# Altium schematic sheet TEMP+HEATER.SchDoc
size A4
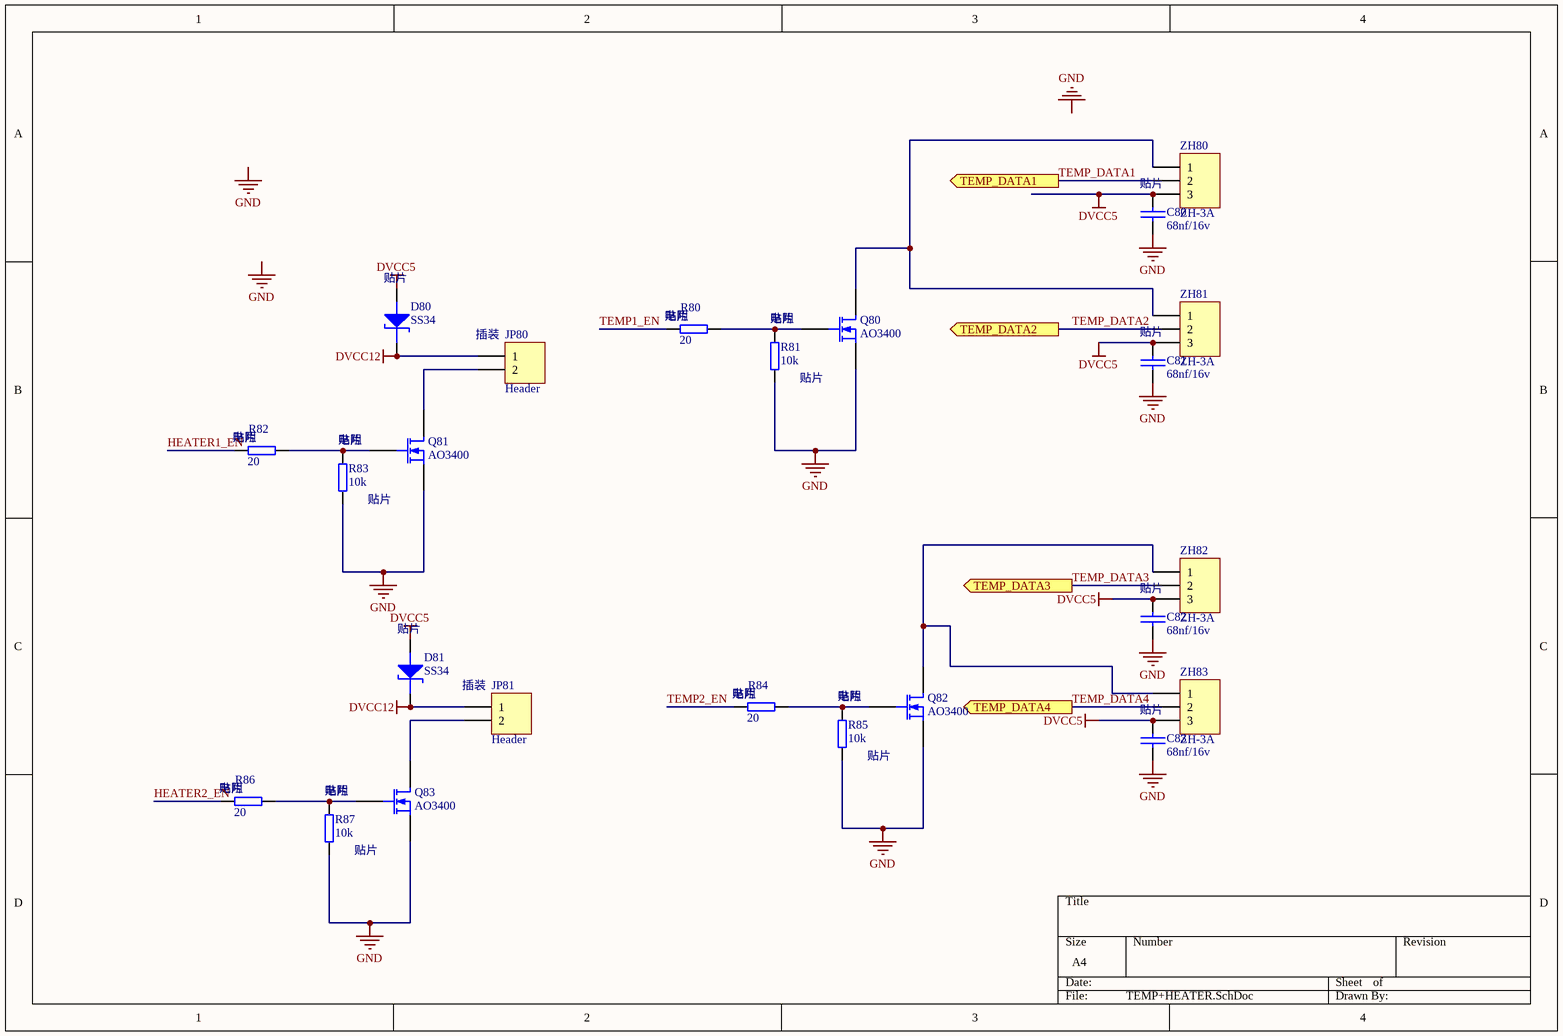
[diagram p0: TEMP+HEATER.SchDoc]

## Parts
C80  68nf/16v  [C0402]
C81  68nf/16v  [C0402]
C82  68nf/16v  [C0402]
C83  68nf/16v  [C0402]
D80  SS34  [BGY220D]
D81  SS34  [BGY220D]
JP80  Header  [PTC]
JP81  Header  [PTC]
Q80  AO3400  [SI2300]
Q81  AO3400  [SI2300]
Q82  AO3400  [SI2300]
Q83  AO3400  [SI2300]
R80  20  [R0402]
R81  10k  [R0402]
R82  20  [R0402]
R83  10k  [R0402]
R84  20  [R0402]
R85  10k  [R0402]
R86  20  [R0402]
R87  10k  [R0402]
ZH80  ZH-3A  [DS18B20]
ZH81  ZH-3A  [DS18B20]
ZH82  ZH-3A  [DS18B20]
ZH83  ZH-3A  [DS18B20]

## Ports
TEMP_DATA1 (out), TEMP_DATA2 (out), TEMP_DATA3 (out), TEMP_DATA4 (out)

## Nets
DVCC5: C80.2 C81.2 C82.2 C83.2 D80.1(A) D81.1(A) ZH80.3 ZH81.3 ZH82.3 ZH83.3
DVCC12: D80.2(K) D81.2(K) JP80.1 JP81.1
GND: C80.1 C81.1 C82.1 C83.1 Q80.3(S) Q81.3(S) Q82.3(S) Q83.3(S) R81.2 R83.2 R85.2 R87.2
HEATER1_EN: R82.2
HEATER2_EN: R86.2
TEMP1_EN: R80.2
TEMP2_EN: R84.2
TEMP_DATA1: ZH80.2 ; port TEMP_DATA1
TEMP_DATA2: ZH81.2 ; port TEMP_DATA2
TEMP_DATA3: ZH82.2 ; port TEMP_DATA3
TEMP_DATA4: ZH83.2 ; port TEMP_DATA4
NetJP80_2: JP80.2 Q81.1(D)
NetJP81_2: JP81.2 Q83.1(D)
NetQ80_1: Q80.1(D) ZH80.1 ZH81.1
NetQ80_2: Q80.2(G) R80.1 R81.1
NetQ81_2: Q81.2(G) R82.1 R83.1
NetQ82_1: Q82.1(D) ZH82.1 ZH83.1
NetQ82_2: Q82.2(G) R84.1 R85.1
NetQ83_2: Q83.2(G) R86.1 R87.1

## Notes on the sheet
- Labels drawn without touching a wire or pin: GND
- (in symbol 1N5819) 贴片
- (in symbol CC) 贴片
- (in symbol Header 2) 插装
- (in symbol MOSFET-N) 贴片
- (in symbol RES1) 电阻; 贴片

## Library data of the parts
C80-C83 = CC: C; 大?: 0.1uf/50v; 封?: 0603
D80 D81 = 1N5819: 型?: 1N5819/SS14; 产?: *; 厂?: *; 大?: *; 封?: *; 价?: *; 资?: *
JP80 JP81 = Header 2: Header, 2-Pin; 产地: *; 厂商: *; 大小: *; 封?: *; 资?: *; 价格: *
Q80-Q83 = MOSFET-N: N-Channel MOSFET; pin to pad: 1>3 2>1 3>2; 元?: N-MOS; 产地: *; 厂商: *; 大小: *; 封?: *; 型号: AO3400; 物?: *
R80-R87 = RES1: 价格: 0.01; 封?: 0603
  R80 R82 R84 R86: 大小: 20
  R81 R83 R85 R87: 大小: 10k
ZH80-ZH83 = ZH-3A: 1.5mm; LatestRevisionDate: 17-Jul-2002; LatestRevisionNote: Re-released for DXP Platform.; Publisher: Altium Limited